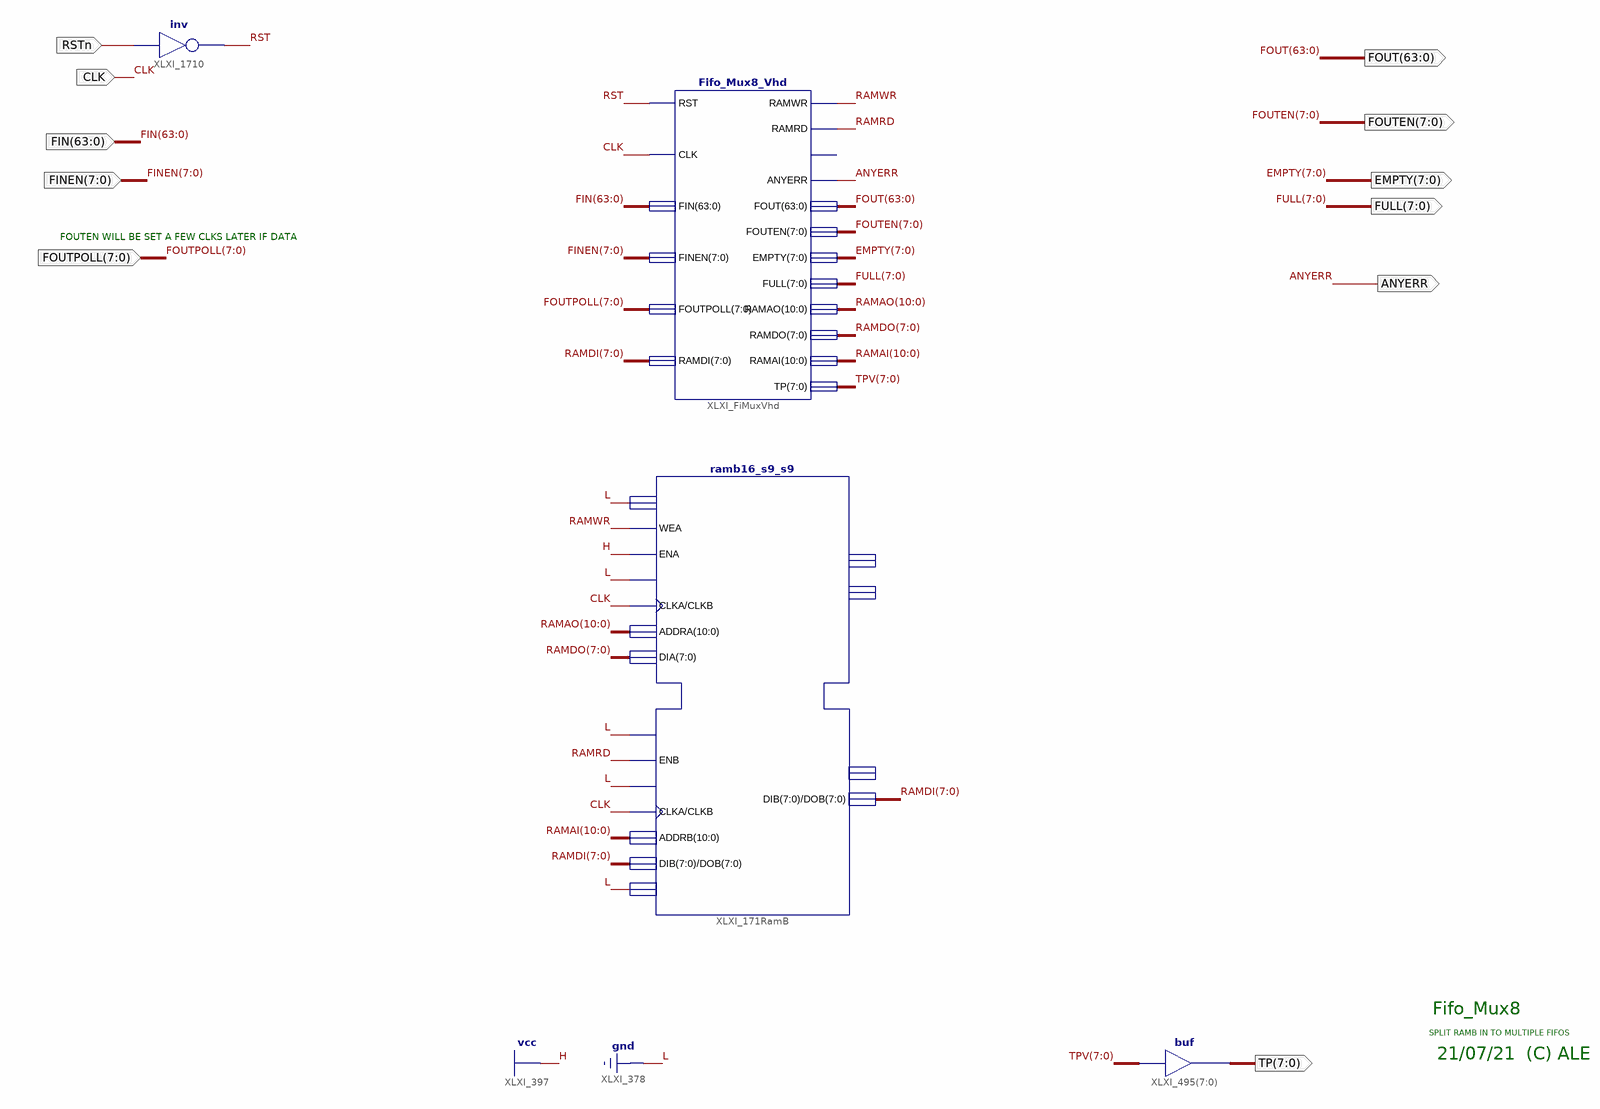
[diagram p0: schematic sheet 1]
// Xilinx ISE schematic Fifo_Mux8.sch (spartan3e) as structural Verilog: 4 symbols, 11 ports
module Fifo_Mux8 (
  input  CLK,
  input  RSTn,
  input  [63:0] FIN,
  input  [7:0] FINEN,
  input  [7:0] FOUTPOLL,
  output [63:0] FOUT,
  output [7:0] TP,
  output [7:0] FOUTEN,
  output ANYERR,
  output [7:0] EMPTY,
  output [7:0] FULL
);

  wire RAMRD, RAMWR, RST;
  wire [7:0] RAMDI, RAMDO, TPV;
  wire [10:0] RAMAI, RAMAO;

  assign TP = TPV;  // buf XLXI_495[7..0], 8 bits wide
  not XLXI_1710 (RST, RSTn);
  ramb16_s9_s9 XLXI_171RamB (
    .ADDRA(RAMAO), .ADDRB(RAMAI), .CLKA(CLK), .CLKB(CLK), .DIA(RAMDO), .DIB(RAMDI), .DIPA(1'b0), .DIPB(1'b0),
    .ENA(1'b1), .ENB(RAMRD), .SSRA(1'b0), .SSRB(1'b0), .WEA(RAMWR), .WEB(1'b0), .DOB(RAMDI));  // open: DOA, DOPA, DOPB
  Fifo_Mux8_Vhd XLXI_FiMuxVhd (
    .RST(RST), .CLK(CLK), .FIN(FIN), .FINEN(FINEN), .FOUTPOLL(FOUTPOLL), .RAMDI(RAMDI), .RAMWR(RAMWR),
    .RAMRD(RAMRD), .ANYERR(ANYERR), .FOUT(FOUT), .FOUTEN(FOUTEN), .EMPTY(EMPTY), .FULL(FULL), .RAMAO(RAMAO),
    .RAMDO(RAMDO), .RAMAI(RAMAI), .TP(TPV));  // open: ERR

  // Notes on the sheet:
  //   FOUTEN WILL BE SET A FEW CLKS LATER IF DATA
  //   Fifo_Mux8
  //   SPLIT RAMB IN TO MULTIPLE FIFOS
  //   21/07/21  (C) ALE
endmodule
